# Altium project HSM.PrjPcb
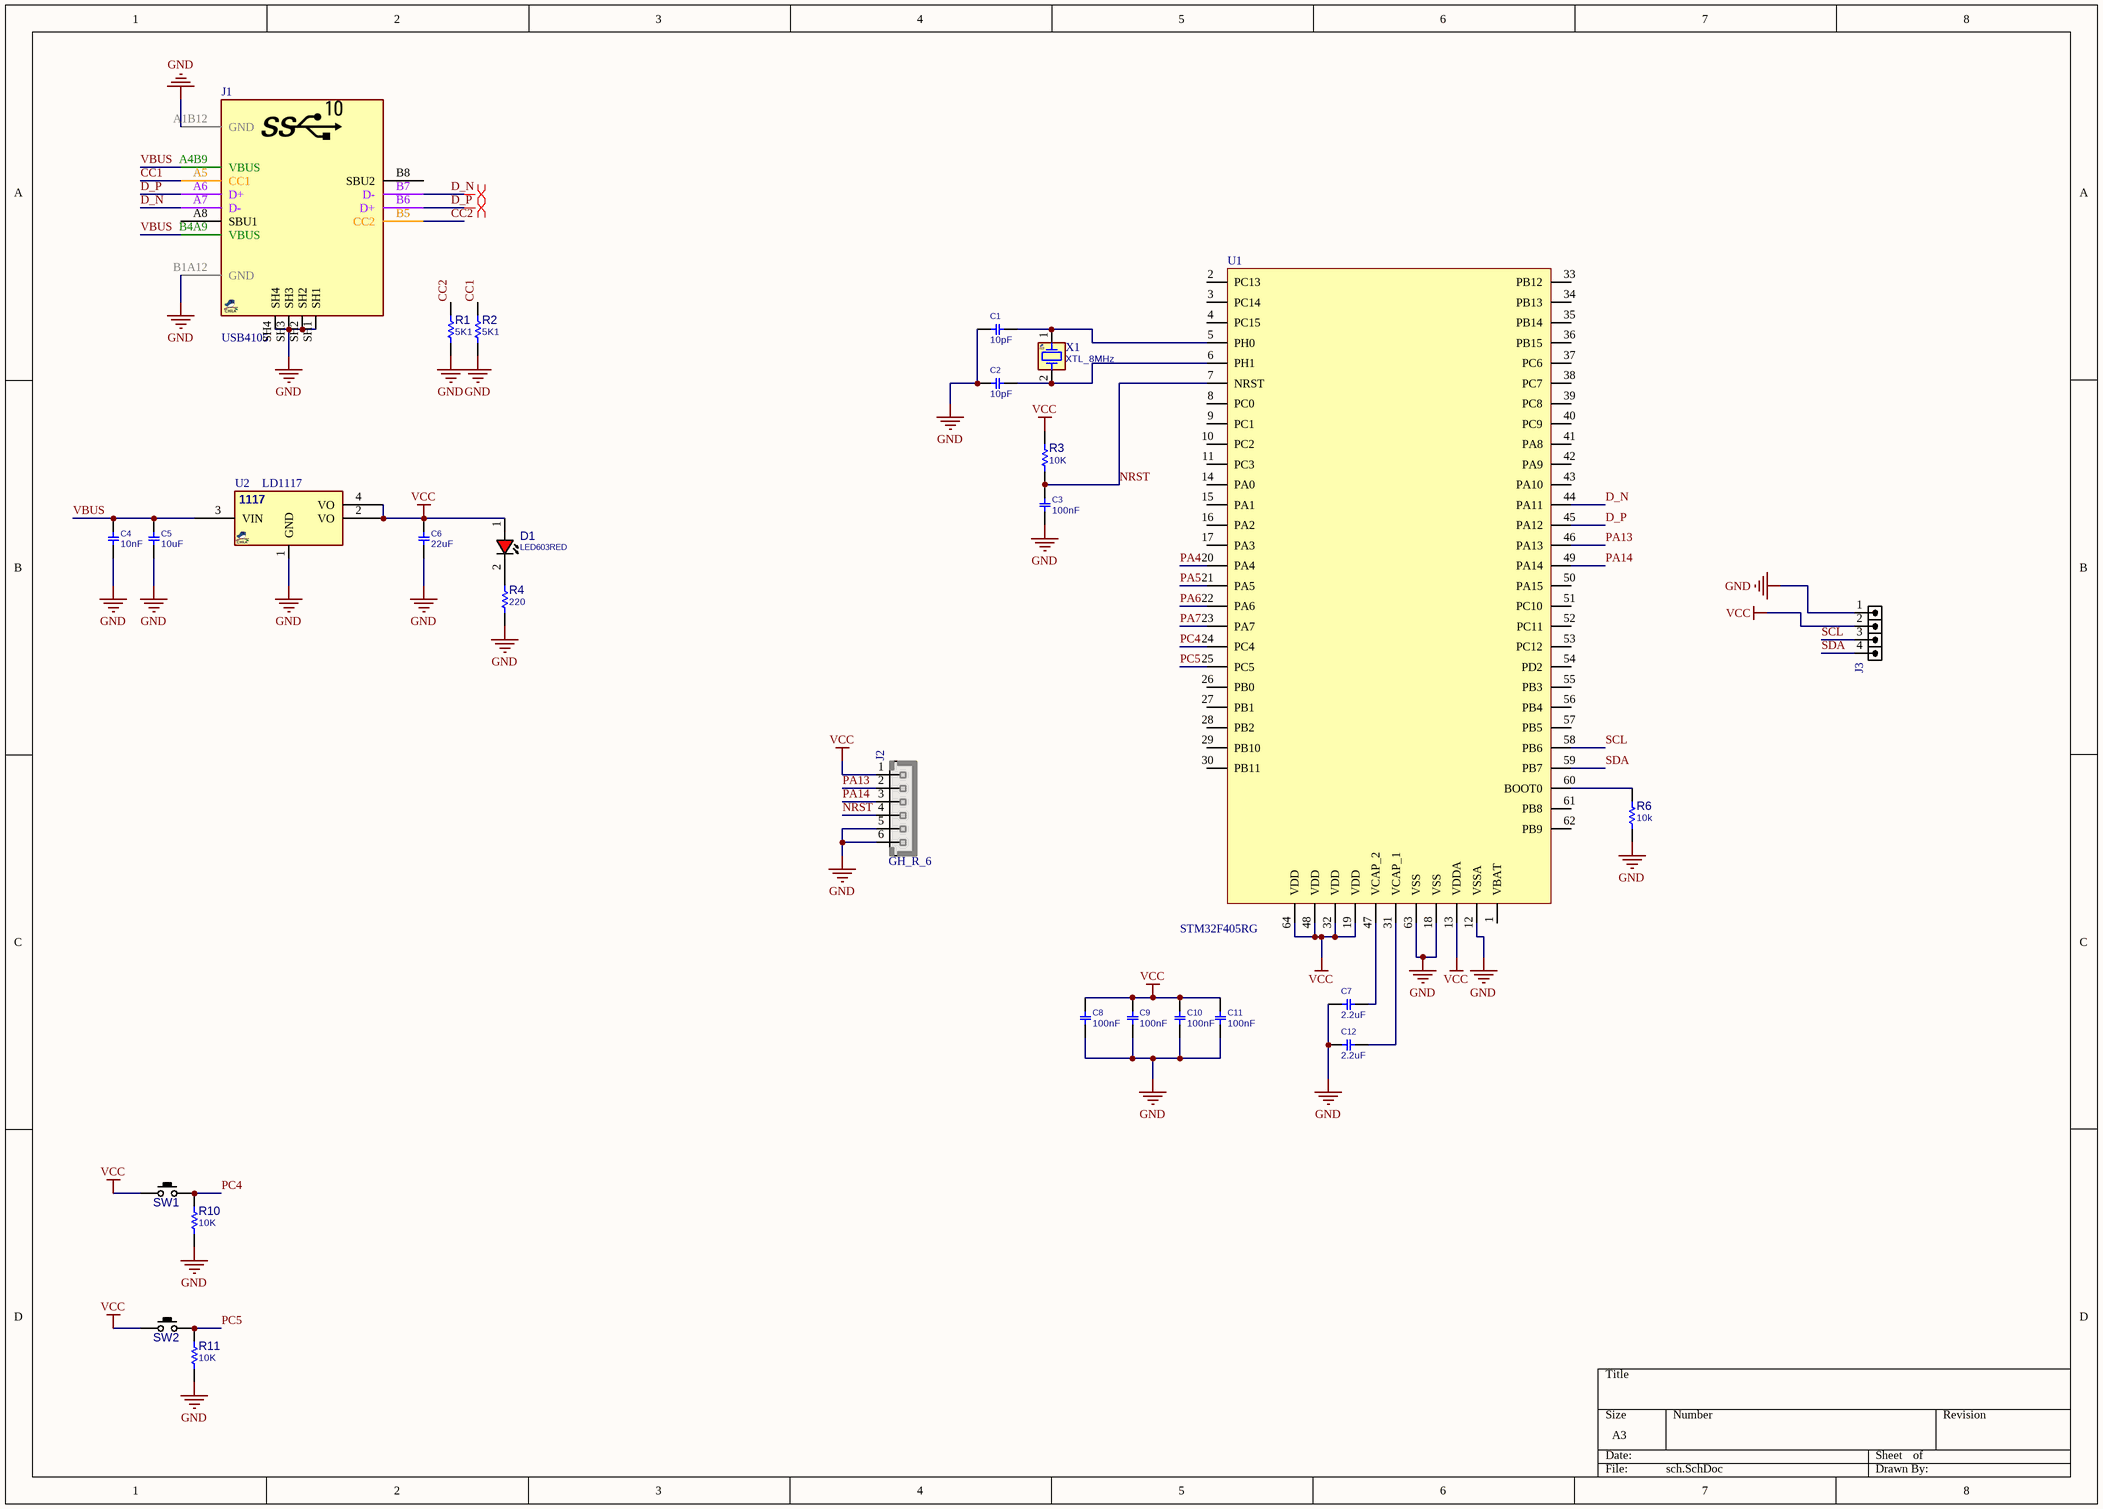
[diagram p0: sch.SchDoc]
1 sheet, 28 parts. Net scope: global (net labels, ports and power ports of the same name join across sheets).
Board file: pcb.PcbDoc

## Sheet sch.SchDoc
size A3

### Parts
C1  10pF  [C0603]
C2  10pF  [C0603]
C3  100nF  [C0603]
C4  10nF  [C0603]
C5  10uF  [C0603]
C6  22uF  [C0603]
C7  2.2uF  [C0603]
C8  100nF  [C0603]
C9  100nF  [C0603]
C10  100nF  [C0603]
C11  100nF  [C0603]
C12  2.2uF  [C0603]
D1  LED603RED  [LED0603RED]
J1  USB4105  [USBC_SMD_16_USB4105]
J2  GH_R_6  [GH_R_6]
J3  HDR1X4  [HDRMINI_M_1X4]  (value not drawn)
R1  5K1  [R0603]
R2  5K1  [R0603]
R3  10K  [R0603]
R4  220  [R0603]
R6  10k  [R0603]
R10  10K  [R0603]
R11  10K  [R0603]
SW1  PUSHBUTTON  [SWPBT_SPST_R_6X6X6]  (value not drawn)
SW2  PUSHBUTTON  [SWPBT_SPST_R_6X6X6]  (value not drawn)
U1  STM32F405RG  [QFG50_64]
U2  LD1117  [SOT223_4]
X1  XTL_8MHz  [XTL_2_11X5]

### Nets
GND: C1.1 C2.1 C3.1 C4.1 C5.1 C6.1 C7.1 C8.1 C9.1 C10.1 C11.1 C12.1 J1.A1B12(GND) J1.B1A12(GND) J1.SH1 J1.SH2 J1.SH3 J1.SH4 J2.5 J2.6 J3.1 R1.1 R2.1 R4.1 R6.1 R10.1 R11.1 U1.12(VSSA) U1.18(VSS) U1.63(VSS) U2.1(GND)
VCC: C6.2 C8.2 C9.2 C10.2 C11.2 D1.1(ANODE) J2.1 J3.2 R3.2 SW1.1 SW2.1 U1.13(VDDA) U1.19(VDD) U1.32(VDD) U1.48(VDD) U1.64(VDD) U2.2(VO) U2.4(VO)
CC1: J1.A5(CC1) R2.2
CC2: J1.B5(CC2) R1.2
D_N: J1.A7(D-) J1.B7(D-) U1.44(PA11)
D_P: J1.A6(D+) J1.B6(D+) U1.45(PA12)
NRST: C3.2 J2.4 R3.1 U1.7(NRST)
PA4: U1.20(PA4)
PA5: U1.21(PA5)
PA6: U1.22(PA6)
PA7: U1.23(PA7)
PA13: J2.2 U1.46(PA13)
PA14: J2.3 U1.49(PA14)
PC4: R10.2 SW1.2 U1.24(PC4)
PC5: R11.2 SW2.2 U1.25(PC5)
SCL: J3.3 U1.58(PB6)
SDA: J3.4 U1.59(PB7)
VBUS: C4.2 C5.2 J1.A4B9(VBUS) J1.B4A9(VBUS) U2.3(VIN)
NetC1_2: C1.2 U1.5(PH0) X1.1(OSC1)
NetC2_2: C2.2 U1.6(PH1) X1.2(OSC2)
NetC7_2: C7.2 U1.47(VCAP_2)
NetC12_2: C12.2 U1.31(VCAP_1)
NetD1_2: D1.2(CATHODE) R4.2
NetR6_2: R6.2 U1.60(BOOT0)

Not connected (* = marked no-connect by the designer): J1 A8(SBU1) B8(SBU2); U1 1(VBAT) 2(PC13) 3(PC14) 4(PC15) 8(PC0) 9(PC1) 10(PC2) 11(PC3) 14(PA0) 15(PA1) 16(PA2) 17(PA3) 26(PB0) 27(PB1) 28(PB2) 29(PB10) 30(PB11) 33(PB12) 34(PB13) 35(PB14) 36(PB15) 37(PC6) 38(PC7) 39(PC8) 40(PC9) 41(PA8) 42(PA9) 43(PA10) 50(PA15) 51(PC10) 52(PC11) 53(PC12) 54(PD2) 55(PB3) 56(PB4) 57(PB5) 61(PB8) 62(PB9)

### Layout directives
differential pair: D_N, D_P

### Notes on the sheet
- (in symbol VREG_1117_SOT223) 1117

### Library data of the parts
C1-C12 = CAP_SMD_MLCC_0603: CAP, MLCC; PARAM: -, -%; MANF_P#: MANF_PART#; PARAM2: -V; PRICE: 100= 1$; MANF: -; ASSEMBLY: ASSEMBLY
  C1 C2: VALUE: 10pF
  C3 C8-C11: VALUE: 100nF
  C4: VALUE: 10nF
  C5: VALUE: 10uF
  C6: VALUE: 22uF
  C7 C12: VALUE: 2.2uF
D1 = LED_SMD_0603_RED: LED, SMD, 0603, RED; PARAM: 30mA, 640nm; DESC: DESCRIPTION; MANF_P#: MANF_PART#; PARAM2: 1.8~2.5V; MANF: MANF; ASSEMBLY: ASSEMBLY; PRICE: PRICE; VALUE: LED603RED
J1 = CONN_USBC_SMD_16_USB4105: CONN, USB, Type C, USB 2.0, Right-Angle, SMD; MANF: GCT; MANF_P#: USB4105-GF-A; PARAM: 5A; Price: 1.5$; Value: USB4105
J2 = GH_R_6: JST GH Series, pitch: 1.25mm, 1.0A/50v; PARAM2: 50v; PARAM: 1.0A; MANF: JST; VALUE: GH_R_6
J3 = HDRMINI_M_1X4: CONN, HEADER, Male, pitch: 1.27mm, 4POS; VALUE: HDRMINI_4
R1-R4 R6 R10 R11 = RES_SMD_0603: RESISTOR, SMD; PARAM: 1%, 0.1W; DESC: DESCRIPTION; DIST#: MOUSER; MANF_P#: -; MANF: -; ASSEMBLY: ASSEMBLY; PRICE: -; PARAM2: -
  R1 R2: VALUE: 5K1
  R3 R10 R11: VALUE: 10K
  R4: VALUE: 220
  R6: VALUE: 10k
SW1 SW2 = SWPBT_SPST_R_6X6X6_SKHHLUA010: SWITCH, PUSH BUTTON, TACTILE, THD, SPST, 6X6X6mm RIGHT; MANF: ALPS; DESC: DESCRIPTION; VALUE: PUSHBUTTON; ASSEMBLY: ASSEMBLY; PARAM: PARAM; PRICE: PRICE; MANF_P#: SKHHLUA010
U2 = VREG_1117_SOT223: REG, Linear, LDO1V, 0.8A, SOT-223; MANF_P#: LD1117, LM1117, AMS1117, TLV1117, REG1117, NCP1117, LT1117, SPX1117; MANF: TI, ON, ST; PARAM2: 1.2/1.5/1.8/2.5/2.85/3.3/5V; PARAM: LDO1V, 0.8A; VALUE: LD1117
X1 = XTL_2_HC49_8MHz_SMD: Crystal MOST POPULAR ABL HC49 PACKAGE; MANF: ABRACON; MANF_P#: ABLS-8.000MHZ-B4-T; PARAM: 8MHz, 18pF, 30PPM, -20~70oC; PRICE: 0.3$; VALUE: XTL_8MHz